# Altium schematic sheet Sensorboard.SchDoc: Sensorboard
size A4; CheckedBy: <UPN>; Author: Daniel Frei; CompanyName: Berner Fachhochschule; DrawnBy: freid2; Organization: Technik und Informatik; Address1: Qellgasse 21; Address2: 2501 Biel/Bienne; DocumentNumber: <DOC NO>; Revision: 1.0; SheetNumber: 1; SheetTotal: 1; ProjectName: Sensorboard
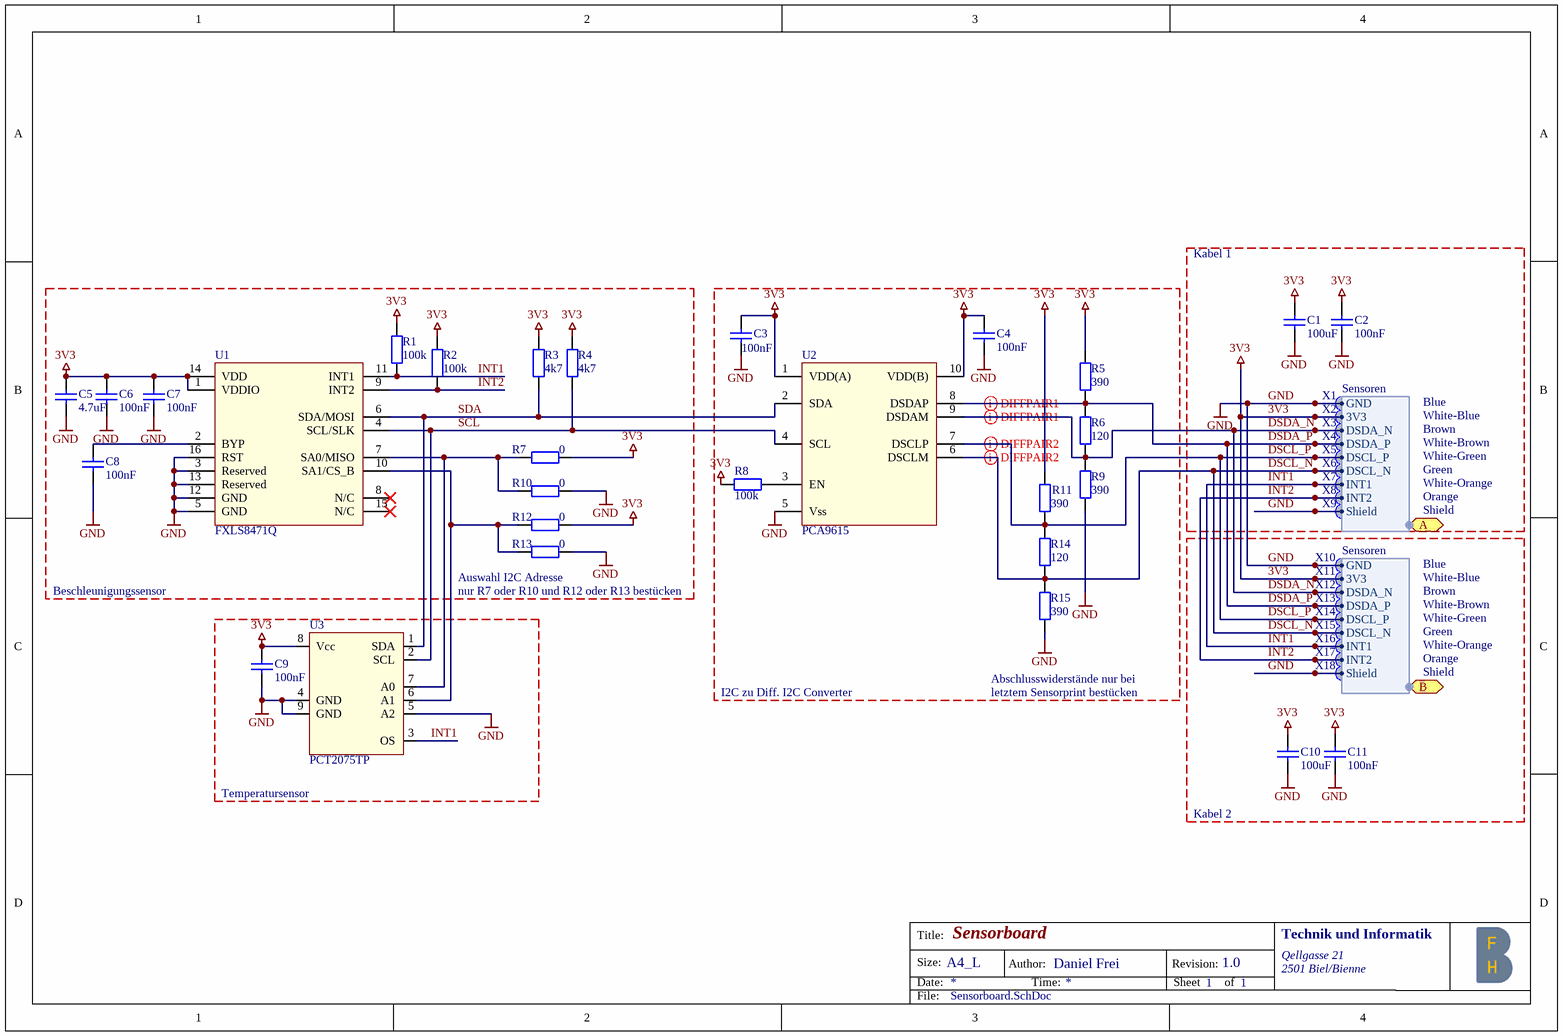
[diagram p0: Sensorboard.SchDoc]

## Parts
C1  100uF  [CAPC3225[1210]X120]
C2  100nF  [CAPC1005[0402]X50]
C3  100nF  [CAPC1005[0402]X50]
C4  100nF  [CAPC1005[0402]X50]
C5  4.7uF  [CAPC1608[0603]X80]
C6  100nF  [CAPC1005[0402]X50]
C7  100nF  [CAPC1005[0402]X50]
C8  100nF  [CAPC1005[0402]X50]
C9  100nF  [CAPC1005[0402]X50]
C10  100uF  [CAPC3225[1210]X120]
C11  100nF  [CAPC1005[0402]X50]
R1  100k  [RESC1005[0402]X35]
R2  100k  [RESC1005[0402]X35]
R3  4k7  [RESC1005[0402]X35]
R4  4k7  [RESC1005[0402]X35]
R5  390  [RESC1005[0402]X35]
R6  120  [RESC1005[0402]X35]
R7  0  [RESC1005[0402]X35]
R8  100k  [RESC1005[0402]X35]
R9  390  [RESC1005[0402]X35]
R10  0  [RESC1005[0402]X35]
R11  390  [RESC1005[0402]X35]
R12  0  [RESC1005[0402]X35]
R13  0  [RESC1005[0402]X35]
R14  120  [RESC1005[0402]X35]
R15  390  [RESC1005[0402]X35]
U1  FXLS8471Q  [16 LEAD QFN]
U2  PCA9615  [TSSOP10]
U3  PCT2075TP  [HWSON8]
X1  Loch  [Loch]  (value not drawn)
X2  Loch  [Loch]  (value not drawn)
X3  Loch  [Loch]  (value not drawn)
X4  Loch  [Loch]  (value not drawn)
X5  Loch  [Loch]  (value not drawn)
X6  Loch  [Loch]  (value not drawn)
X7  Loch  [Loch]  (value not drawn)
X8  Loch  [Loch]  (value not drawn)
X9  Loch  [Loch]  (value not drawn)
X10  Loch  [Loch]  (value not drawn)
X11  Loch  [Loch]  (value not drawn)
X12  Loch  [Loch]  (value not drawn)
X13  Loch  [Loch]  (value not drawn)
X14  Loch  [Loch]  (value not drawn)
X15  Loch  [Loch]  (value not drawn)
X16  Loch  [Loch]  (value not drawn)
X17  Loch  [Loch]  (value not drawn)
X18  Loch  [Loch]  (value not drawn)

## Blocks framed on the sheet
Temperatursensor: C9 U3

## Ports
A (harness Sensoren), B (harness Sensoren)

## Harnesses
Sensoren: 3V3, DSCL_N, DSCL_P, DSDA_N, DSDA_P, GND, INT1, INT2, Shield

## Nets
3V3: C1.2 C2.2 C3.2 C4.2 C5.2 C6.2 C7.2 C9.2 C10.2 C11.2 R1.2 R2.2 R3.2 R4.2 R5.2 R7.2 R8.1 R11.2 R12.2 U1.1(VDDIO) U1.14(VDD) U2.1(VDD(A)) U2.10(VDD(B)) U3.8(Vcc) X2.1 X11.1 ; port B.3V3, port A.3V3
GND: C1.1 C2.1 C3.1 C4.1 C5.1 C6.1 C7.1 C8.1 C9.1 C10.1 C11.1 R9.1 R10.2 R13.2 R15.1 U1.3(Reserved) U1.5(GND) U1.12(GND) U1.13(Reserved) U1.16(RST) U2.5(Vss) U3.4(GND) U3.5(A2) U3.9(GND) X1.1 X9.1 X10.1 X18.1 ; port B.GND, port B.Shield, port A.GND, port A.Shield
DSCL_N: R14.1 R15.2 U2.6(DSCLM) X6.1 X15.1 ; port B.DSCL_N, port A.DSCL_N
DSCL_P: R11.1 R14.2 U2.7(DSCLP) X5.1 X14.1 ; port B.DSCL_P, port A.DSCL_P
DSDA_N: R6.1 R9.2 U2.9(DSDAM) X3.1 X12.1 ; port B.DSDA_N, port A.DSDA_N
DSDA_P: R5.1 R6.2 U2.8(DSDAP) X4.1 X13.1 ; port B.DSDA_P, port A.DSDA_P
INT1: R1.1 U1.11(INT1) U3.3(OS) X7.1 X16.1 ; port B.INT1, port A.INT1
INT2: R2.1 U1.9(INT2) X8.1 X17.1 ; port B.INT2, port A.INT2
SCL: R4.1 U1.4(SCL/SLK) U2.4(SCL) U3.2(SCL)
SDA: R3.1 U1.6(SDA/MOSI) U2.2(SDA) U3.1(SDA)
NetC8_2: C8.2 U1.2(BYP)
NetR7_1: R7.1 R10.1 U1.7(SA0/MISO) U3.7(A0)
NetR8_2: R8.2 U2.3(EN)
NetR12_1: R12.1 R13.1 U1.10(SA1/CS_B) U3.6(A1)

Not connected (* = marked no-connect by the designer): U1 8(N/C)* 15(N/C)*

## Layout directives
differential pair: DSCL_N, DSCL_P, DSDA_N, DSDA_P

## Notes on the sheet
- Kabel 1
- Blue
- White-Blue
- White-Brown
- Brown
- Shield
- White-Green
- White-Orange
- Green
- Orange
- (near R13) Auswahl I2C Adresse
- Beschleunigungssensor
- (near R13) nur R7 oder R10 und R12 oder R13 bestücken
- I2C zu Diff. I2C Converter
- Abschlusswiderstände nur bei
- letztem Sensorprint bestücken
- Kabel 2
- Title:
- Size:
- Date:
- A4_L
- Author:
- Time:
- Revision:
- Sheet
- of
- File:

## Library data of the parts
C1 C10 = C: Capacitor; Manufacturer: Murata; Manufacturer Part Number: GRM32ER61A107ME20L; Modified_by: BEP1; Modified: 10.2008; Type: *; Voltage: *; Value: 100uF; Supplier 1: Digi-Key; Supplier 2: Mouser; Supplier Part Number 1: 490-9969-1-ND; Supplier Part Number 2: 81-GRM32ER61A107ME0L
C2-C4 C6-C9 C11 = C: Capacitor; Modified_by: BEP1; Modified: 10.2008; Type: *; Voltage: *; Value: 100nF
C5 = C: Capacitor; Manufacturer: Murata; Manufacturer Part Number: GRM188R61A475KE15D; Modified_by: BEP1; Voltage: 10V; Modified: 10.2008; Type: *; Value: 4.7uF; Supplier 1: Digi-Key; Supplier 2: Mouser; Supplier Part Number 1: 490-10477-1-ND; Supplier Part Number 2: 81-GRM188R61A475KE5D
R1-R6 R8 R9 R11 R14 R15 = R: Resistor; Modified_by: BEP1; Modified: 10.2008
  R1 R2 R8: Value: 100k
  R3 R4: Value: 4k7
  R5 R9 R11 R15: Value: 390
  R6 R14: Value: 120
R7 R10 R12 R13 = R: Resistor; Manufacturer: Panasonic; Manufacturer Part Number: ERJ-2GE0R00X; Modified_by: BEP1; Modified: 10.2008; Value: 0; Supplier 1: Digi-Key; Supplier 2: Mouser; Supplier Part Number 1: P0.0JCT-ND; Supplier Part Number 2: 667-ERJ-2GE0R00X
U1 = FXLS8471Q: 3-Axis,  Linear Accelerometer; Manufacturer Part Number: FXLS8471QR1; Manufacturer: NXP; Value: FXLS8471Q; Supplier Part Number 2: 841-FXLS8471QR1; Supplier Part Number 1: FXLS8471QR1CT-ND; Supplier 2: Mouser; Supplier 1: Digi-Key
U2 = PCA9615: differential I2C-bus buffer; Manufacturer Part Number: PCA9615DPJ; Manufacturer: NXP; Value: PCA9615; Supplier Part Number 2: 771-PCA9615DPJ; Supplier Part Number 1: 568-11484-1-ND; Supplier 1: Digi-Key; Supplier 2: Mouser
U3 = PCT2075TP: Temperature_Sensor; Manufacturer: NXP; Manufacturer Part Number: PCT2075TP,147; Value: PCT2075TP; Supplier 1: Digi-Key; Supplier 2: Mouser; Supplier Part Number 1: 568-10220-1-ND; Supplier Part Number 2: 771-PCT2075TP147
X1-X18 = Loch: Loch in Print um Kabel einzulöten